# EAGLE design ultra-violet-tooth-sensor-mk-1.2 (EAGLE 6.5.0)
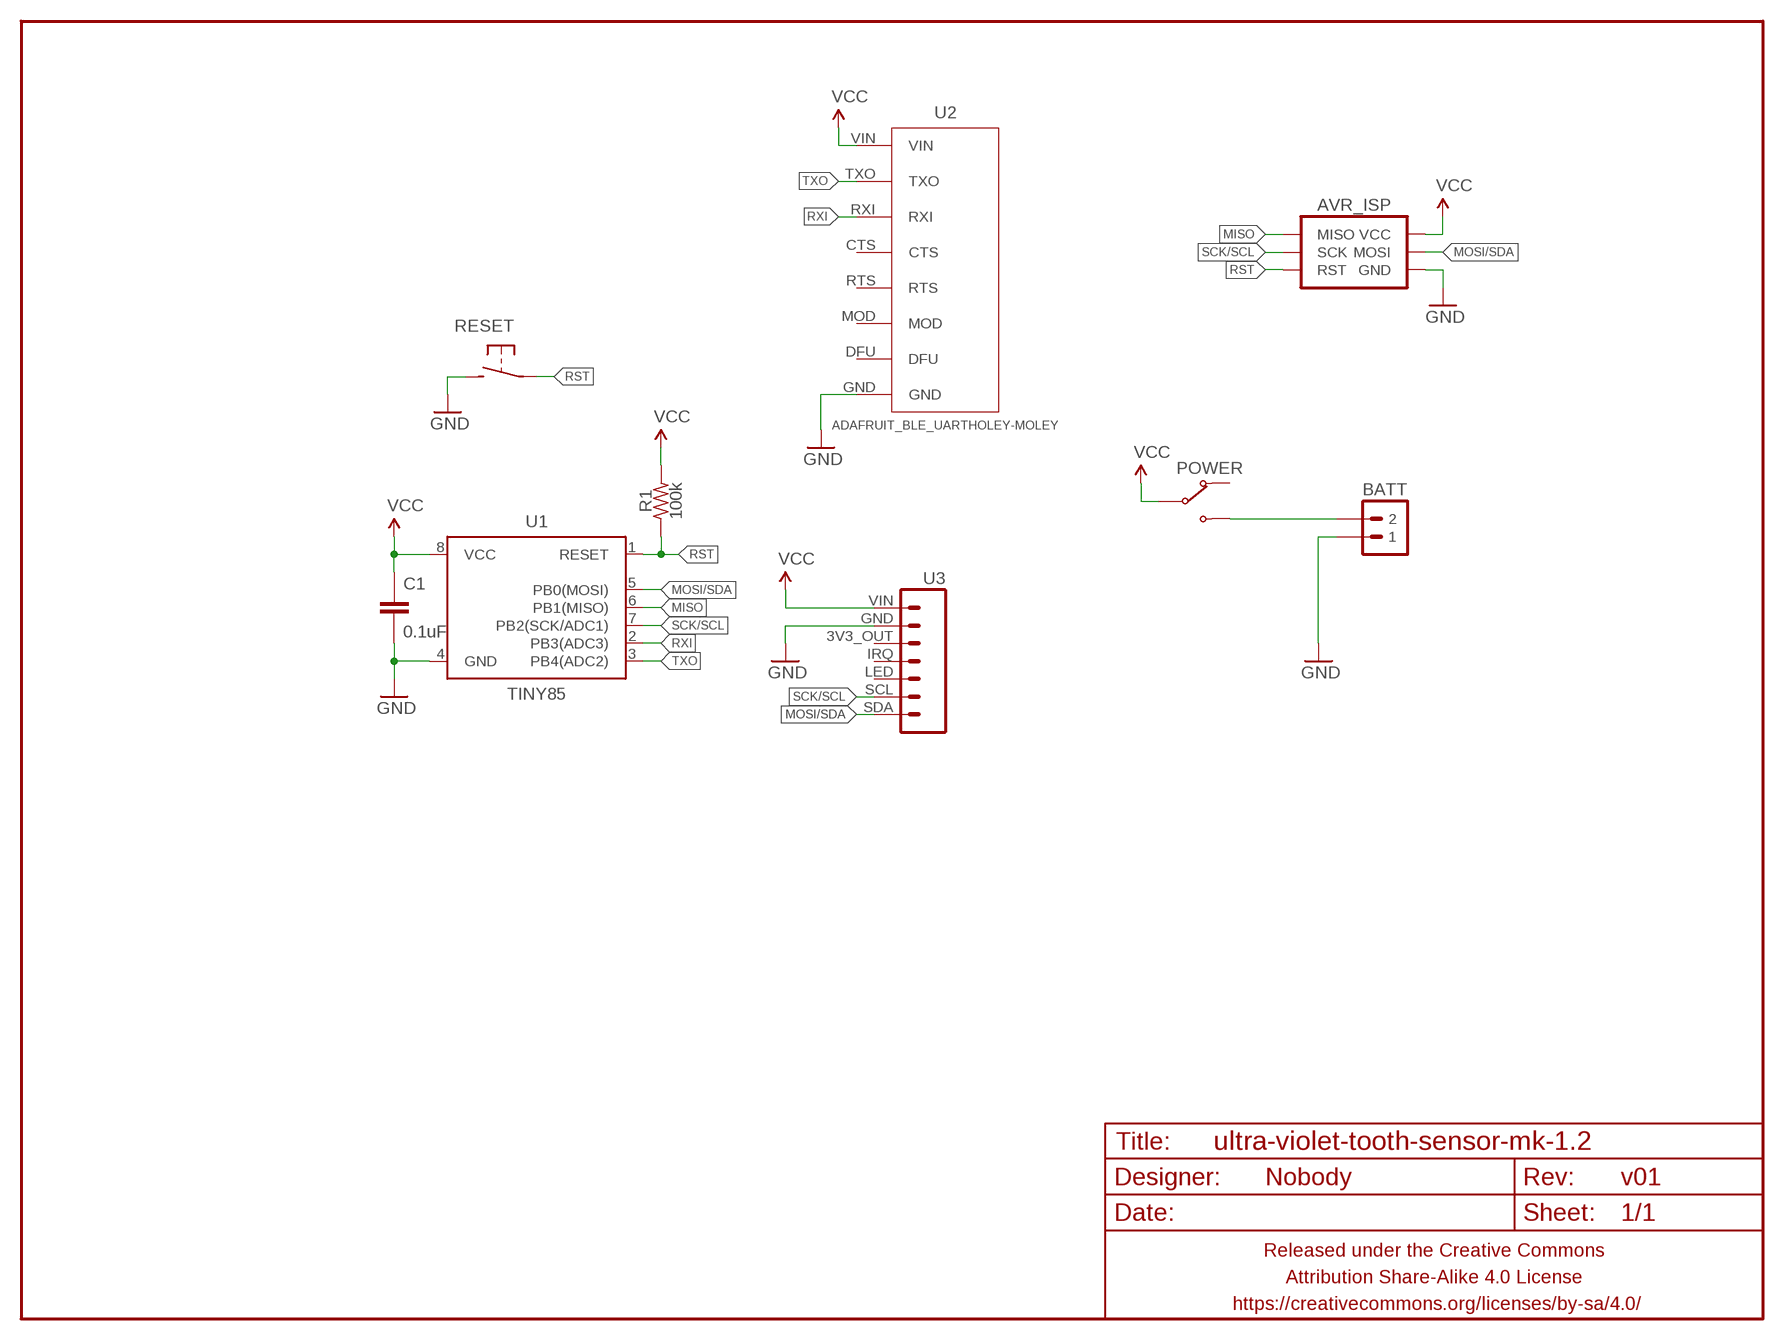
[diagram p0: schematic, sheet 1]

## Parts
AVR_ISP  AVR_SPI_PRG_6PTH  [2X3]
BATT  M02PTH-CENTERED-R+  [1X02-CENTER-R+]
C1  0.1uF  CAPACITOR-CERAMIC025-024X044  [C025-024X044]
FRAME1  FRAME-LETTERNO_PACKAGE  [DUMMY]
POWER  SWITCH-SPDTPTH-RA-2.54MM  [SPDT-RA-2.54MM]
R1  100k  RESISTORPTH-AXIAL-6.35MM  [RESISTOR-AXIAL-PTH-6.35MM]
RESET  SPST-NO-TACT3MM-RA  [TACTILE-PTH-SIDE]
U1  TINY85  ATTINY45TINY85-20-DIP  [DIP08]
U2  ADAFRUIT_BLE_UARTHOLEY-MOLEY  [ADAFRUIT_BLE_UART_HOLEY]
U3  ADAFRUIT-SI1145-BREAKOUT  [ADAFRUIT-SI1145-BREAKOUT]

## Nets
GND: AVR_ISP.6(GND) BATT.1 C1.2 RESET.2 U1.4(GND) U2.GND U3.GND
MISO: AVR_ISP.1(MISO) U1.6(PB1(MISO))
MOSI/SDA: AVR_ISP.4(MOSI) U1.5(PB0(MOSI)) U3.SDA
N$1: BATT.2 POWER.3(NO)
RST: AVR_ISP.5(RST) R1.P$1 RESET.1 U1.1(RESET)
RXI: U1.2(PB3(ADC3)) U2.RXI
SCK/SCL: AVR_ISP.3(SCK) U1.7(PB2(SCK/ADC1)) U3.SCL
TXO: U1.3(PB4(ADC2)) U2.TXO
VCC: AVR_ISP.2(VCC) C1.1 POWER.2(COM) R1.P$2 U1.8(VCC) U2.VIN U3.VIN
Unconnected: POWER.1(NC) U2.CTS U2.DFU U2.MOD U2.RTS U3.3V3_OUT U3.IRQ U3.LED

## Library data of the parts
AVR_ISP = A_butts:AVR_SPI_PRG_6: AVR ISP 6 Pin This is the reduced ISP connector for AVR programming. Common on Arduino. This footprint will take up less PCB space and can be used with a 10-pin to 6-pin adapter such as SKU: BOB-08508 **Special note about "TEST_POINT" package. The stop mask is on the top side, so if you want your programming test points to be on the bottom of your board, make sure to place this package on the bottom side of the board. This also ensure that the orientation to program from the bottom side will be correct.
BATT = A_butts:M02: Standard 2-pin 0.1" header. Use with - straight break away headers ( PRT-00116) - right angle break away headers (PRT-00553) - swiss pins (PRT-00743) - machine pins (PRT-00117) - female headers (PRT-00115) Molex polarized connector foot print use with: PRT-08233 with associated crimp pins and housings. 2.54_SCREWTERM for use with PRT-10571. 3.5mm Screw Terminal footprints for PRT-08084 5mm Screw Terminal footprints for use with PRT-08433
C1 = A_butts:CAPACITOR-CERAMIC: CAPACITOR, European symbol
FRAME1 = A_butts:FRAME-LETTER: Schematic Frame Standard 8.5x11 US Letter frame; DESIGNER: Nobody; VERSION: v01
POWER = A_butts:SWITCH-SPDT
R1 = A_butts:RESISTOR: RESISTOR, American symbol
RESET = A_butts:SPST-NO-TACT
U1 = A_butts:ATTINY45: Atmel 8-pin 2/4/8kB flash uC; PROD_ID: IC-09445; VALUE: TINY85-20-DIP
U2 = A_butts:ADAFRUIT_BLE_UART
U3 = A_butts:ADAFRUIT-SI1145-BREAKOUT

## Board
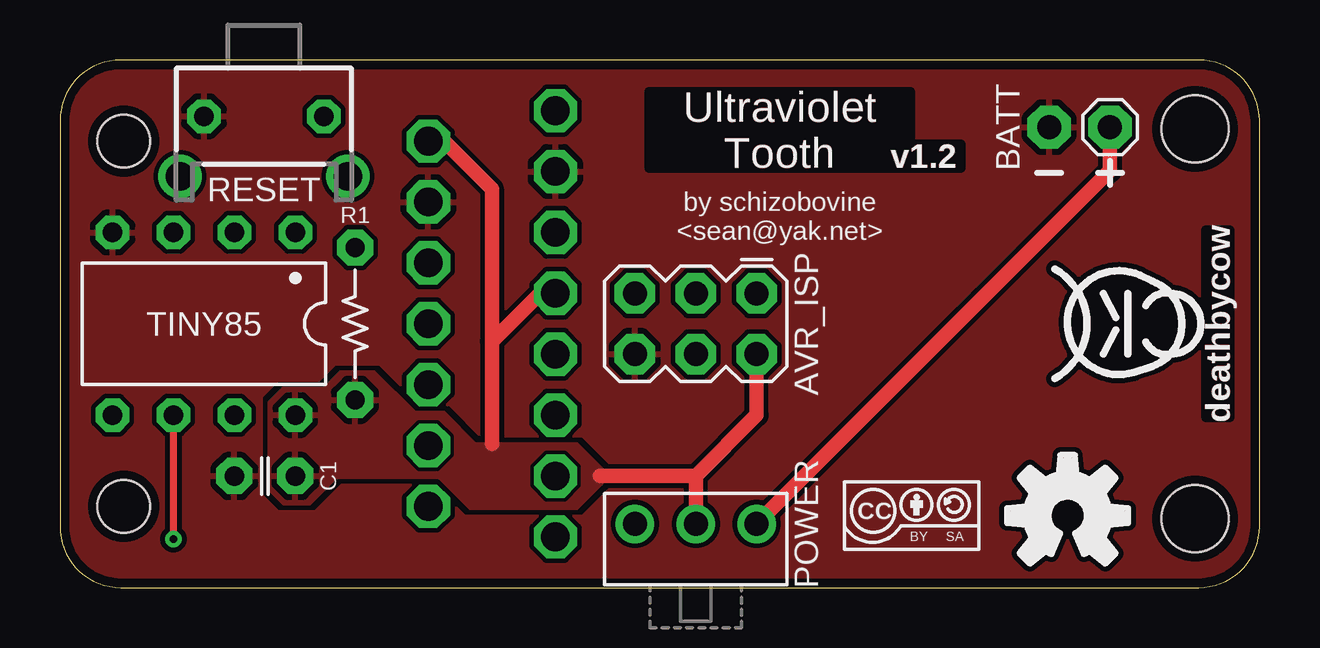
[diagram p1: board, top side]
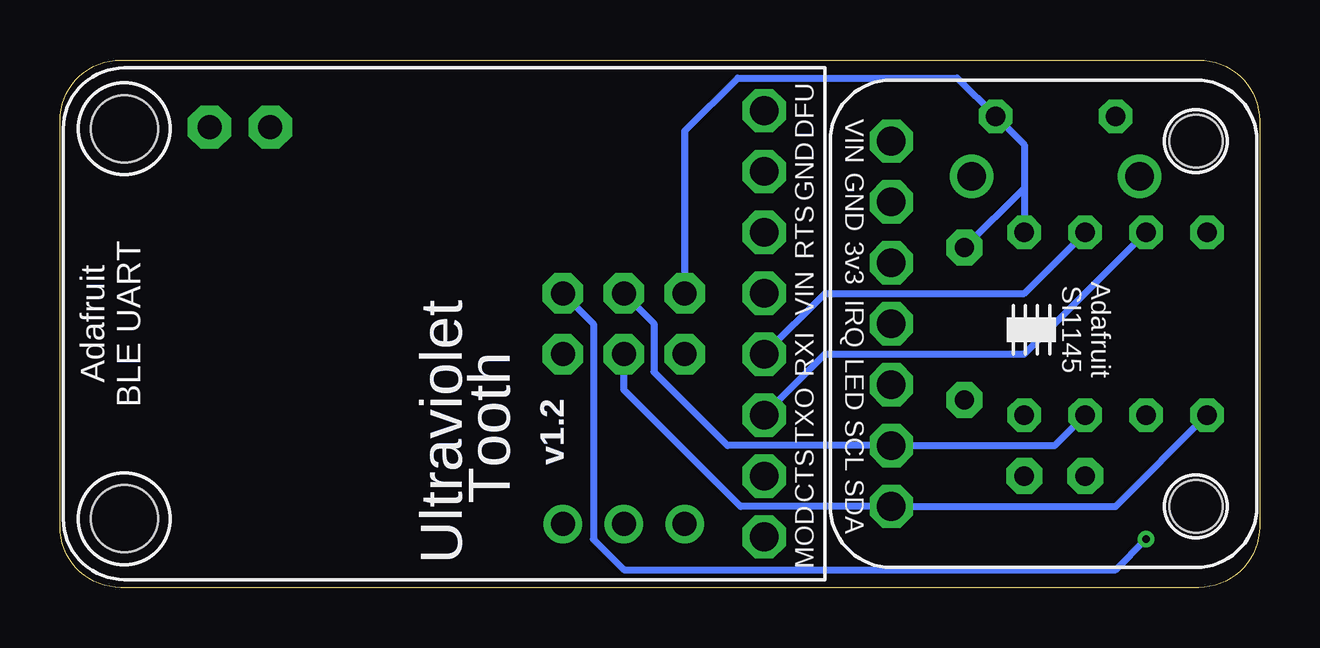
[diagram p2: board, bottom side, seen from below]

Size 50 x 22 mm. Coordinates in mm from the lower left corner, seen from the top.
Outline: 0,19.46 0,2.54 arc90 2.54,0 47.46,0 arc90 50,2.54 50,19.46 arc90 47.46,22 2.54,22 arc90 0,19.46
Copper layers (1*16): Top 0.0356mm / dielectric 1.5011mm / Bottom 0.0356mm
Design rules "LaenPCBOrder_2": minimum track width 6mil, minimum drill 13mil, track to track 6mil, track to pad 6mil, pad to pad 6mil, via to via 6mil, smd to smd 6mil, copper to edge 15mil, drill to drill 6mil, minimum pad ring 7mil, minimum via ring 7mil, stop-mask expansion 3mil, vias tented up to drill 20mil, thermal gap 10mil

### Footprints (pad centres in the part's own frame; a part is rotated, then mirrored left to right if it is on the bottom)
2X3 = drill 1 pad 1.676 octagon: 1 -2.54,-1.27; 2 -2.54,1.27; 3 0,-1.27; 4 0,1.27; 5 2.54,-1.27; 6 2.54,1.27
1X02-CENTER-R+ = drill 1 pad 1.8 octagon: 1 -1.27,0; 2 1.27,0
C025-024X044 = drill 0.813 pad 1.5 octagon: 1 -1.27,0; 2 1.27,0
SPDT-RA-2.54MM = drill 1 pad 1.6: 1 0,0; 2 2.54,0; 3 5.08,0
RESISTOR-AXIAL-PTH-6.35MM = drill 0.8 pad 1.5 octagon: P$1 -3.175,0; P$2 3.175,0
TACTILE-PTH-SIDE = drill 0.8 pad 1.4 octagon: 1 -2.5,0; 2 2.5,0 | drill 1.2 pad 1.778: ANCHOR1 -3.5,2.5; ANCHOR2 3.5,2.5
DIP08 = drill 0.8 pad 1.4 octagon: 1 -3.81,-3.81; 2 -1.27,-3.81; 3 1.27,-3.81; 4 3.81,-3.81; 5 3.81,3.81; 6 1.27,3.81; 7 -1.27,3.81; 8 -3.81,3.81
ADAFRUIT_BLE_UART_HOLEY = drill 1.2 pad 1.8 octagon: CTS -6.35,0; DFU 8.89,0; GND 6.35,0; MOD -8.89,0; RTS 3.81,0; RXI -1.27,0; TXO -3.81,0; VIN 1.27,0 | hole 2.8: -8.128,26.67; 8.128,26.67
ADAFRUIT-SI1145-BREAKOUT = drill 1.2 pad 1.8 octagon: 3V3_OUT -2.54,-6.35; GND -5.08,-6.35; IRQ 0,-6.35; LED 2.54,-6.35; SCL 5.08,-6.35; SDA 7.62,-6.35; VIN -7.62,-6.35 | hole 2.2: -7.62,6.35; 7.62,6.35

### Placement (x,y rotation side)
AVR_ISP  26.5,11 180 top
BATT  42.5,19.2 0 top
C1  8.54,4.65 180 top
FRAME1  0,0 0 top
POWER  23.96,2.65 0 top
R1  12.3,11 270 top
RESET  8.5,19.65 180 top
U1  6,11 180 top
U2  20.65,11 90 bottom
U3  9,11 270 bottom
U$1  [CC-BY-SA-4.0-NO-URL]  35.5,3 0 top
U$3  [OSHWLOGO_TOP_0.2]  42,3 0 top
U$4  [COW_SMALL_METAL]  44,11 90 top

### Tracks (layer width: path | path; a pad name or v marks a point on that pad's centre or on a via)
GND
  pour Top (isolate 0.2, rank 6): -0.1,-0.1 -0.1,22.1 50.1,22.1 50.1,-0.1
MISO  (via drill 0.33)
  Top 0.3: v4.73,2.02 U1.6
  Bottom 0.3: AVR_ISP.1 27.77,11 27.77,2.02 26.5,0.75 6,0.75 v4.73,2.02
MOSI/SDA
  Bottom 0.3: U1.5 6,3.38 U3.SDA 21.63,3.38 26.5,8.25 AVR_ISP.4
N$1
  Top 0.6: BATT.2 43.77,17.38 POWER.3
RST
  Bottom 0.3: AVR_ISP.5 23.96,19.04 21.75,21.25 12.6,21.25 RESET.1 9.81,18.46 9.81,16.66 | 9.81,16.66 U1.1 | R1.P$1 9.81,16.66
RXI
  Bottom 0.3: U1.2 9.81,12.27 18.11,12.27 U2.RXI
SCK/SCL
  Bottom 0.3: U1.7 8.54,5.92 U3.SCL 22.17,5.92 25.25,9 25.25,11.02 AVR_ISP.3
TXO
  Bottom 0.3: U1.3 9.81,9.73 18.11,9.73 U2.TXO
VCC
  Top 0.6: POWER.2 26.5,4.65 | 22.5,4.65 26.5,4.65 | 26.5,4.65 29.04,7.19 AVR_ISP.2 | 18,10.27 18,16.62 16,18.62 U3.VIN | 18,10.27 18,6 | U2.VIN 20,12.27 18,10.27
  pour Top: 22.6,4.95 22.6,4.35 21.55,3.3 17.1,3.3 15.8,4.6 11.5,4.6 10.4,3.5 9.32,3.5 8.72,4.1 8.72,7.72 9.3,8.3 11,8.3 11.7,9 13.1,9 14.8,7.3 16,7.3 17.3,6 21.55,6

### Text on the board
Top: Ultraviolet / Tooth
Bottom: Tooth | Ultraviolet
tPlace: Ultraviolet / Tooth | by schizobovine / <sean@yak.net>
bPlace: Tooth | Ultraviolet